# Altium schematic sheet FPGA_U1_Auto.SchDoc
size A2; DocumentNumber: 7; SheetNumber: 7; SheetTotal: 7; Generated From FPGA Project: LedMatrix.PrjFpg; UNUSED_SPECIAL: RouteSeparate; UNUSED_IO: NoERC; VREF: NoERC; UNUSED_INPUT: NoERC
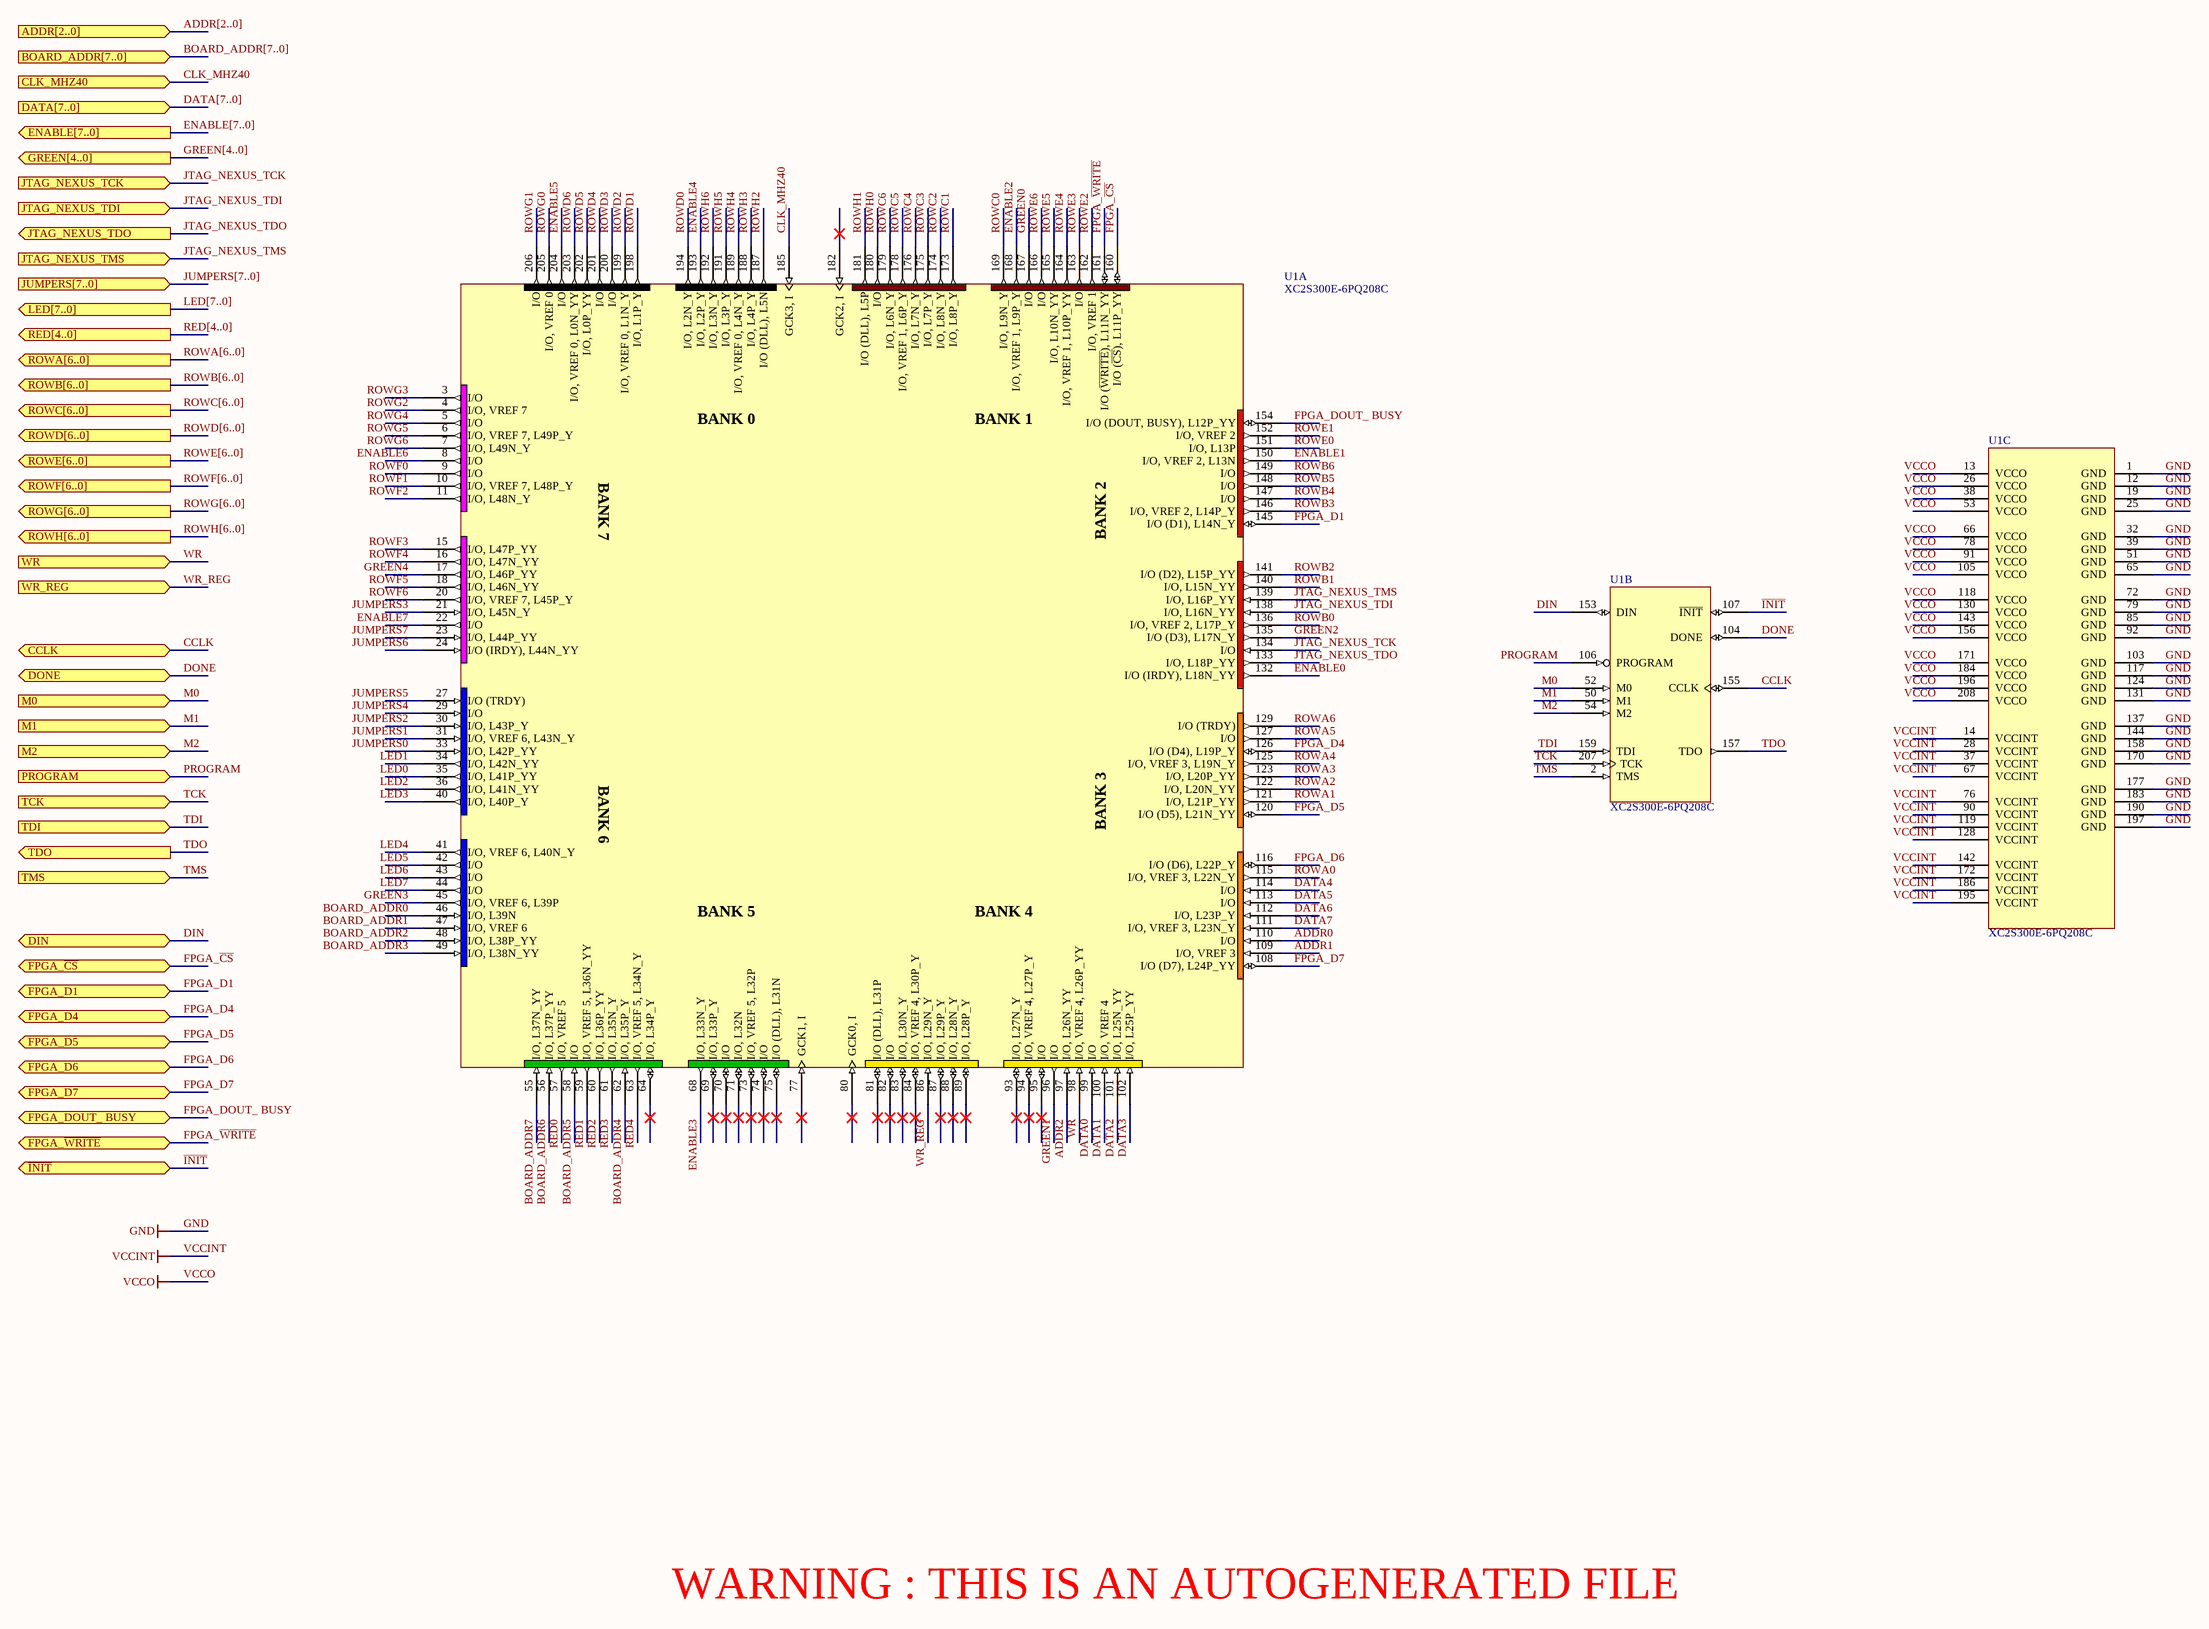
[diagram p0: FPGA_U1_Auto.SchDoc]

## Parts
U1  XC2S300E-6PQ208C  [PQ208]  (parts A,B,C of 3)

## Ports
ADDR[2..0] (in), BOARD_ADDR[7..0] (in), CCLK (bidir), CLK_MHZ40 (in), DATA[7..0] (in), DIN (bidir), DONE (bidir), ENABLE[7..0] (out), FPGA_D1 (bidir), FPGA_D4 (bidir), FPGA_D5 (bidir), FPGA_D6 (bidir), FPGA_D7 (bidir), FPGA_DOUT_ BUSY (bidir), FPGA_~{CS} (bidir), FPGA_~{WRITE} (bidir), GREEN[4..0] (out), JTAG_NEXUS_TCK (in), JTAG_NEXUS_TDI (in), JTAG_NEXUS_TDO (out), JTAG_NEXUS_TMS (in), JUMPERS[7..0] (in), LED[7..0] (out), M0 (in), M1 (in), M2 (in), PROGRAM (in), RED[4..0] (out), ROWA[6..0] (out), ROWB[6..0] (out), ROWC[6..0] (out), ROWD[6..0] (out), ROWE[6..0] (out), ROWF[6..0] (out), ROWG[6..0] (out), ROWH[6..0] (out), TCK (in), TDI (in), TDO (out), TMS (in), WR (in), WR_REG (in), ~{INIT} (bidir)

## Nets
GND: U1.1(GND) U1.12(GND) U1.19(GND) U1.25(GND) U1.32(GND) U1.39(GND) U1.51(GND) U1.65(GND) U1.72(GND) U1.79(GND) U1.85(GND) U1.92(GND) U1.103(GND) U1.117(GND) U1.124(GND) U1.131(GND) U1.137(GND) U1.144(GND) U1.158(GND) U1.170(GND) U1.177(GND) U1.183(GND) U1.190(GND) U1.197(GND)
VCCINT: U1.14(VCCINT) U1.28(VCCINT) U1.37(VCCINT) U1.67(VCCINT) U1.76(VCCINT) U1.90(VCCINT) U1.119(VCCINT) U1.128(VCCINT) U1.142(VCCINT) U1.172(VCCINT) U1.186(VCCINT) U1.195(VCCINT)
VCCO: U1.13(VCCO) U1.26(VCCO) U1.38(VCCO) U1.53(VCCO) U1.66(VCCO) U1.78(VCCO) U1.91(VCCO) U1.105(VCCO) U1.118(VCCO) U1.130(VCCO) U1.143(VCCO) U1.156(VCCO) U1.171(VCCO) U1.184(VCCO) U1.196(VCCO) U1.208(VCCO)
ADDR0: U1.110(I/O)
ADDR1: U1.109(I/O,_VREF_3)
ADDR2: U1.97(I/O,_L26N_YY)
BOARD_ADDR0: U1.46(I/O,_L39N)
BOARD_ADDR1: U1.47(I/O,_VREF_6)
BOARD_ADDR2: U1.48(I/O,_L38P_YY)
BOARD_ADDR3: U1.49(I/O,_L38N_YY)
BOARD_ADDR4: U1.62(I/O,_L35P_Y)
BOARD_ADDR5: U1.58(I/O)
BOARD_ADDR6: U1.56(I/O,_L37P_YY)
BOARD_ADDR7: U1.55(I/O,_L37N_YY)
CCLK: U1.155(CCLK) ; port CCLK
CLK_MHZ40: U1.185(GCK3,_I) ; port CLK_MHZ40
DATA0: U1.99(I/O)
DATA1: U1.100(I/O,_VREF_4)
DATA2: U1.101(I/O,_L25N_YY)
DATA3: U1.102(I/O,_L25P_YY)
DATA4: U1.114(I/O)
DATA5: U1.113(I/O)
DATA6: U1.112(I/O,_L23P_Y)
DATA7: U1.111(I/O,_VREF_3,_L23N_Y)
DIN: U1.153(DIN) ; port DIN
DONE: U1.104(DONE) ; port DONE
ENABLE0: U1.132(I/O_(IRDY),_L18N_YY)
ENABLE1: U1.150(I/O,_VREF_2,_L13N)
ENABLE2: U1.168(I/O,_VREF_1,_L9P_Y)
ENABLE3: U1.68(I/O,_L33N_Y)
ENABLE4: U1.193(I/O,_L2P_Y)
ENABLE5: U1.204(I/O)
ENABLE6: U1.8(I/O)
ENABLE7: U1.22(I/O)
FPGA_~{CS}: U1.160(I/O_(~{CS}),_L11P_YY) ; port FPGA_~{CS}
FPGA_D1: U1.145(I/O_(D1),_L14N_Y) ; port FPGA_D1
FPGA_D4: U1.126(I/O_(D4),_L19P_Y) ; port FPGA_D4
FPGA_D5: U1.120(I/O_(D5),_L21N_YY) ; port FPGA_D5
FPGA_D6: U1.116(I/O_(D6),_L22P_Y) ; port FPGA_D6
FPGA_D7: U1.108(I/O_(D7),_L24P_YY) ; port FPGA_D7
FPGA_DOUT_ BUSY: U1.154(I/O_(DOUT,_BUSY),_L12P_YY) ; port FPGA_DOUT_ BUSY
FPGA_~{WRITE}: U1.161(I/O_(~{WRITE}),_L11N_YY) ; port FPGA_~{WRITE}
GREEN0: U1.167(I/O)
GREEN1: U1.96(I/O)
GREEN2: U1.135(I/O_(D3),_L17N_Y)
GREEN3: U1.45(I/O,_VREF_6,_L39P)
GREEN4: U1.17(I/O,_L46P_YY)
~{INIT}: U1.107(~{INIT}) ; port ~{INIT}
JTAG_NEXUS_TCK: U1.134(I/O) ; port JTAG_NEXUS_TCK
JTAG_NEXUS_TDI: U1.138(I/O,_L16N_YY) ; port JTAG_NEXUS_TDI
JTAG_NEXUS_TDO: U1.133(I/O,_L18P_YY) ; port JTAG_NEXUS_TDO
JTAG_NEXUS_TMS: U1.139(I/O,_L16P_YY) ; port JTAG_NEXUS_TMS
JUMPERS0: U1.33(I/O,_L42P_YY)
JUMPERS1: U1.31(I/O,_VREF_6,_L43N_Y)
JUMPERS2: U1.30(I/O,_L43P_Y)
JUMPERS3: U1.21(I/O,_L45N_Y)
JUMPERS4: U1.29(I/O)
JUMPERS5: U1.27(I/O_(TRDY))
JUMPERS6: U1.24(I/O_(IRDY),_L44N_YY)
JUMPERS7: U1.23(I/O,_L44P_YY)
LED0: U1.35(I/O,_L41P_YY)
LED1: U1.34(I/O,_L42N_YY)
LED2: U1.36(I/O,_L41N_YY)
LED3: U1.40(I/O,_L40P_Y)
LED4: U1.41(I/O,_VREF_6,_L40N_Y)
LED5: U1.42(I/O)
LED6: U1.43(I/O)
LED7: U1.44(I/O)
M0: U1.52(M0) ; port M0
M1: U1.50(M1) ; port M1
M2: U1.54(M2) ; port M2
PROGRAM: U1.106(PROGRAM) ; port PROGRAM
RED0: U1.57(I/O,_VREF_5)
RED1: U1.59(I/O,_VREF_5,_L36N_YY)
RED2: U1.60(I/O,_L36P_YY)
RED3: U1.61(I/O,_L35N_Y)
RED4: U1.63(I/O,_VREF_5,_L34N_Y)
ROWA0: U1.115(I/O,_VREF_3,_L22N_Y)
ROWA1: U1.121(I/O,_L21P_YY)
ROWA2: U1.122(I/O,_L20N_YY)
ROWA3: U1.123(I/O,_L20P_YY)
ROWA4: U1.125(I/O,_VREF_3,_L19N_Y)
ROWA5: U1.127(I/O)
ROWA6: U1.129(I/O_(TRDY))
ROWB0: U1.136(I/O,_VREF_2,_L17P_Y)
ROWB1: U1.140(I/O,_L15N_YY)
ROWB2: U1.141(I/O_(D2),_L15P_YY)
ROWB3: U1.146(I/O,_VREF_2,_L14P_Y)
ROWB4: U1.147(I/O)
ROWB5: U1.148(I/O)
ROWB6: U1.149(I/O)
ROWC0: U1.169(I/O,_L9N_Y)
ROWC1: U1.173(I/O,_L8P_Y)
ROWC2: U1.174(I/O,_L8N_Y)
ROWC3: U1.175(I/O,_L7P_Y)
ROWC4: U1.176(I/O,_L7N_Y)
ROWC5: U1.178(I/O,_VREF_1,_L6P_Y)
ROWC6: U1.179(I/O,_L6N_Y)
ROWD0: U1.194(I/O,_L2N_Y)
ROWD1: U1.198(I/O,_L1P_Y)
ROWD2: U1.199(I/O,_VREF_0,_L1N_Y)
ROWD3: U1.200(I/O)
ROWD4: U1.201(I/O)
ROWD5: U1.202(I/O,_L0P_YY)
ROWD6: U1.203(I/O,_VREF_0,_L0N_YY)
ROWE0: U1.151(I/O,_L13P)
ROWE1: U1.152(I/O,_VREF_2)
ROWE2: U1.162(I/O,_VREF_1)
ROWE3: U1.163(I/O)
ROWE4: U1.164(I/O,_VREF_1,_L10P_YY)
ROWE5: U1.165(I/O,_L10N_YY)
ROWE6: U1.166(I/O)
ROWF0: U1.9(I/O)
ROWF1: U1.10(I/O,_VREF_7,_L48P_Y)
ROWF2: U1.11(I/O,_L48N_Y)
ROWF3: U1.15(I/O,_L47P_YY)
ROWF4: U1.16(I/O,_L47N_YY)
ROWF5: U1.18(I/O,_L46N_YY)
ROWF6: U1.20(I/O,_VREF_7,_L45P_Y)
ROWG0: U1.205(I/O,_VREF_0)
ROWG1: U1.206(I/O)
ROWG2: U1.4(I/O,_VREF_7)
ROWG3: U1.3(I/O)
ROWG4: U1.5(I/O)
ROWG5: U1.6(I/O,_VREF_7,_L49P_Y)
ROWG6: U1.7(I/O,_L49N_Y)
ROWH0: U1.180(I/O)
ROWH1: U1.181(I/O_(DLL),_L5P)
ROWH2: U1.187(I/O_(DLL),_L5N)
ROWH3: U1.188(I/O,_L4P_Y)
ROWH4: U1.189(I/O,_VREF_0,_L4N_Y)
ROWH5: U1.191(I/O,_L3P_Y)
ROWH6: U1.192(I/O,_L3N_Y)
TCK: U1.207(TCK) ; port TCK
TDI: U1.159(TDI) ; port TDI
TDO: U1.157(TDO) ; port TDO
TMS: U1.2(TMS) ; port TMS
WR: U1.98(I/O,_VREF_4,_L26P_YY) ; port WR
WR_REG: U1.86(I/O,_L29N_Y) ; port WR_REG

Not connected (* = marked no-connect by the designer): U1 64(I/O,_L34P_Y)* 69(I/O,_L33P_Y)* 70(I/O)* 71(I/O,_L32N)* 73(I/O,_VREF_5,_L32P)* 74(I/O)* 75(I/O_(DLL),_L31N)* 77(GCK1,_I)* 80(GCK0,_I)* 81(I/O_(DLL),_L31P)* 82(I/O)* 83(I/O,_L30N_Y)* 84(I/O,_VREF_4,_L30P_Y)* 87(I/O,_L29P_Y)* 88(I/O,_L28N_Y)* 89(I/O,_L28P_Y)* 93(I/O,_L27N_Y)* 94(I/O,_VREF_4,_L27P_Y)* 95(I/O)* 182(GCK2,_I)*

## Buses and harness runs
bus ADDR[2..0] = port ADDR[2..0]
bus BOARD_ADDR[7..0] = port BOARD_ADDR[7..0]
bus DATA[7..0] = port DATA[7..0]
bus ENABLE[7..0] = port ENABLE[7..0]
bus GREEN[4..0] = port GREEN[4..0]
bus JUMPERS[7..0] = port JUMPERS[7..0]
bus LED[7..0] = port LED[7..0]
bus RED[4..0] = port RED[4..0]
bus ROWA[6..0] = port ROWA[6..0]
bus ROWB[6..0] = port ROWB[6..0]
bus ROWC[6..0] = port ROWC[6..0]
bus ROWD[6..0] = port ROWD[6..0]
bus ROWE[6..0] = port ROWE[6..0]
bus ROWF[6..0] = port ROWF[6..0]
bus ROWG[6..0] = port ROWG[6..0]
bus ROWH[6..0] = port ROWH[6..0]

## Notes on the sheet
- WARNING : THIS IS AN AUTOGENERATED FILE
- (in symbol XC2S300E-6PQ208C, part A) BANK 0; BANK 1; BANK 7; BANK 2; BANK 6; BANK 3; BANK 5; BANK 4

## Library data of the parts
U1 = XC2S300E-6PQ208C: Spartan-IIE 1.8V FPGA, 208-Pin PQFP, Standard Performance, Commercial Grade; Package Information: Latest Revision: ver1.1, Oct-2002; Code - JEDEC: MS-029-FA-1; Published: 19-Jul-2002; Revision: 17-Sep-2003: Pin names updated to match datasheet, ver2.1.; Datasheet: Latest Revision: 09-Jul-2003; Package Reference: PQ208; Publisher: Altium Limited